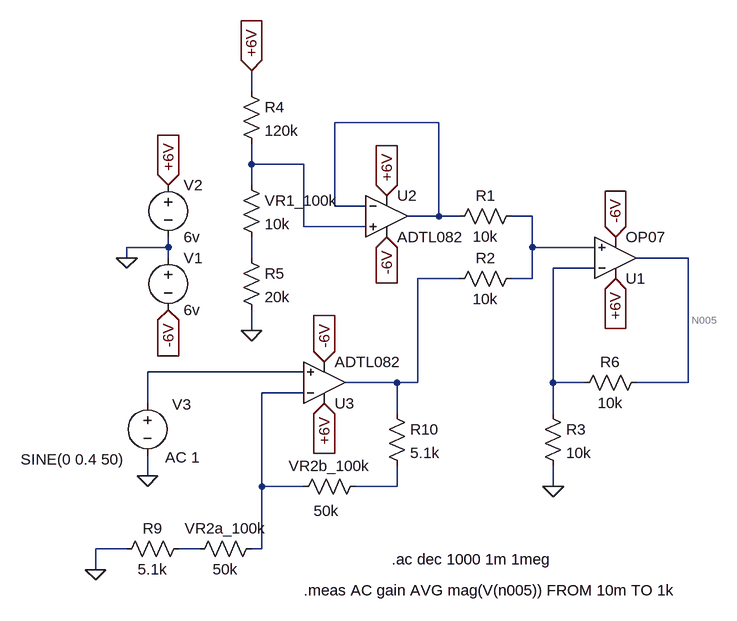
[diagram p0: schematic Summing_Amplifier.asc]
Summing_Amplifier.asc, the LTspice schematic file:
Version 4
SHEET 1 880 836
WIRE 0 -112 0 -144
WIRE 288 -64 128 -64
WIRE 0 0 0 -32
WIRE 80 0 0 0
WIRE 0 32 0 0
WIRE 128 64 128 -64
WIRE 176 64 128 64
WIRE 288 80 288 -64
WIRE 288 80 240 80
WIRE 320 80 288 80
WIRE 432 80 400 80
WIRE 80 96 80 0
WIRE 176 96 80 96
WIRE -128 128 -128 112
WIRE -128 128 -192 128
WIRE 432 128 432 80
WIRE 528 128 432 128
WIRE -192 144 -192 128
WIRE -128 144 -128 128
WIRE 0 144 0 112
WIRE 672 144 592 144
WIRE 528 160 464 160
WIRE 320 176 256 176
WIRE 432 176 432 128
WIRE 432 176 400 176
WIRE 0 256 0 224
WIRE 80 320 -160 320
WIRE 224 336 144 336
WIRE 256 336 256 176
WIRE 256 336 224 336
WIRE 464 336 464 160
WIRE 512 336 464 336
WIRE 672 336 672 144
WIRE 672 336 592 336
WIRE 80 352 16 352
WIRE -160 368 -160 320
WIRE 224 384 224 336
WIRE 464 384 464 336
WIRE -160 480 -160 448
WIRE 16 496 16 352
WIRE 80 496 16 496
WIRE 224 496 224 464
WIRE 224 496 160 496
WIRE 464 496 464 464
WIRE -192 592 -240 592
WIRE -80 592 -112 592
WIRE 16 592 16 496
WIRE 16 592 0 592
WIRE -240 624 -240 592
FLAG -192 144 0
FLAG -160 480 0
FLAG 464 496 0
FLAG 0 256 0
FLAG -128 32 +6V
IOPIN -128 32 In
FLAG 0 -144 +6V
IOPIN 0 -144 In
FLAG 208 48 +6V
IOPIN 208 48 In
FLAG 560 176 +6V
IOPIN 560 176 In
FLAG -128 224 -6V
IOPIN -128 224 In
FLAG 208 112 -6V
IOPIN 208 112 In
FLAG 560 112 -6V
IOPIN 560 112 In
FLAG 112 368 +6V
IOPIN 112 368 In
FLAG 112 304 -6V
IOPIN 112 304 In
FLAG -240 624 0
SYMBOL voltage -128 128 R0
WINDOW 123 0 0 Left 0
WINDOW 39 0 0 Left 0
SYMATTR InstName V1
SYMATTR Value 6v
SYMBOL voltage -128 16 R0
WINDOW 123 0 0 Left 0
WINDOW 39 0 0 Left 0
SYMATTR InstName V2
SYMATTR Value 6v
SYMBOL res 416 64 R90
WINDOW 0 0 56 VBottom 2
WINDOW 3 32 56 VTop 2
SYMATTR InstName R1
SYMATTR Value 10k
SYMBOL res 416 160 R90
WINDOW 0 0 56 VBottom 2
WINDOW 3 32 56 VTop 2
SYMATTR InstName R2
SYMATTR Value 10k
SYMBOL voltage -160 352 R0
WINDOW 123 27 99 Left 2
WINDOW 39 0 0 Left 0
WINDOW 3 -195 102 Left 2
WINDOW 0 38 18 Left 2
SYMATTR Value2 AC 1
SYMATTR Value SINE(0 0.4 50)
SYMATTR InstName V3
SYMBOL res 448 368 R0
SYMATTR InstName R3
SYMATTR Value 10k
SYMBOL res 608 320 R90
WINDOW 0 0 56 VBottom 2
WINDOW 3 32 56 VTop 2
SYMATTR InstName R6
SYMATTR Value 10k
SYMBOL OpAmps\\ADTL082 208 16 R0
SYMATTR InstName U2
SYMBOL res -16 -128 R0
SYMATTR InstName R4
SYMATTR Value 120k
SYMBOL res -16 128 R0
SYMATTR InstName R5
SYMATTR Value 20k
SYMBOL OpAmps\\ADTL082 112 400 M180
SYMATTR InstName U3
SYMBOL res 16 576 R90
WINDOW 0 0 56 VBottom 2
WINDOW 3 32 56 VTop 2
SYMATTR InstName VR2a_100k
SYMATTR Value 50k
SYMBOL res 176 480 R90
WINDOW 0 0 56 VBottom 2
WINDOW 3 69 61 VBottom 2
SYMATTR InstName VR2b_100k
SYMATTR Value 50k
SYMBOL res -16 16 R0
SYMATTR InstName VR1_100k
SYMATTR Value 10k
SYMBOL OpAmps\\OP07 560 208 M180
SYMATTR InstName U1
SYMBOL res -96 576 R90
WINDOW 0 0 56 VBottom 2
WINDOW 3 32 56 VTop 2
SYMATTR InstName R9
SYMATTR Value 5.1k
SYMBOL res 208 368 R0
SYMATTR InstName R10
SYMATTR Value 5.1k
TEXT 216 608 Left 2 !.ac dec 1000 1m 1meg
TEXT 80 656 Left 2 !.meas AC gain AVG mag(V(n005)) FROM 10m TO 1k

The netlist it stands for:
* Summing_Amplifier.asc
V1 0 -6V 6v
V2 +6V 0 6v
R1 N003 N001 10k
R2 N003 N007 10k
V3 N008 0 SINE(0 0.4 50) AC 1
R3 N006 0 10k
R6 N005 N006 10k
XU2 N002 N001 +6V -6V N001 ADTL082  ; pins In+ In- V+ V- OUT
R4 +6V N002 120k
R5 N004 0 20k
XU3 N008 N009 +6V -6V N007 ADTL082  ; pins In+ In- V+ V- OUT
R§VR2a_100k N009 N011 50k
R§VR2b_100k N010 N009 50k
R§VR1_100k N002 N004 10k
XU1 N003 N006 +6V -6V N005 LT1001  ; OP07, pins In+ In- V+ V- OUT
R9 N011 0 5.1k
R10 N007 N010 5.1k
.ac dec 1000 1m 1meg
.meas AC gain AVG mag(V(n005)) FROM 10m TO 1k
.lib ADI.lib
.lib LTC.lib
.backanno
.end